# Altium schematic sheet first.SchDoc
size A; SheetNumber: 1; SheetTotal: 3
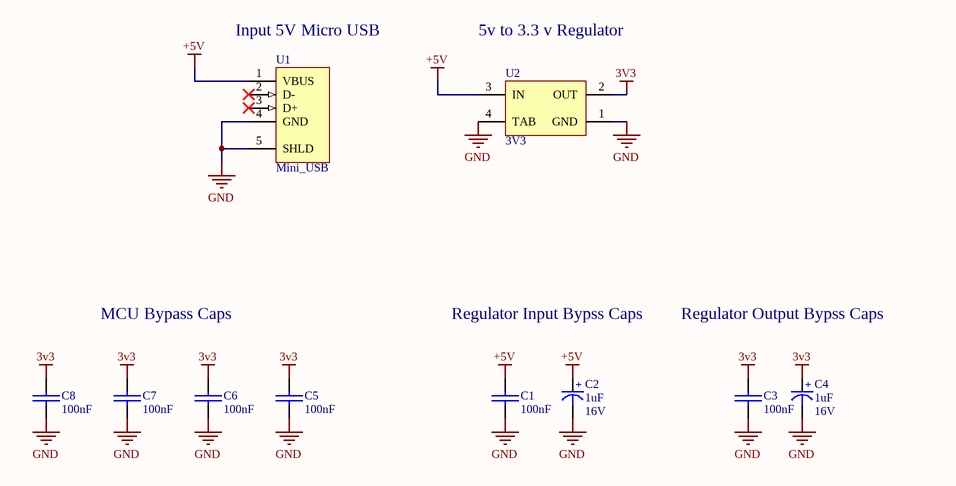
[diagram p0: first.SchDoc]

## Parts
C1  100nF  [SMD_CAP_1206]
C2  Voltage: 16V  [CAPP 2218  Size]  (hidden comment: 1uF)
C3  100nF  [SMD_CAP_1206]
C4  Voltage: 16V  [CAPP 2218  Size]  (hidden comment: 1uF)
C5  100nF  [SMD_CAP_1206]
C6  100nF  [SMD_CAP_1206]
C7  100nF  [SMD_CAP_1206]
C8  100nF  [SMD_CAP_1206]
U1  Mini_USB  [My_USB]
U2  3V3  [SOT223]

## Nets
3V3: C3.1(+) C4.1(+) C5.1(+) C6.1(+) C7.1(+) C8.1(+) U2.2(OUT)
+5V: C1.1(+) C2.1(+) U1.1(VBUS) U2.3(IN)
GND: C1.2(-) C2.2(-) C3.2(-) C4.2(-) C5.2(-) C6.2(-) C7.2(-) C8.2(-) U1.4(GND) U1.5(SHLD) U2.1(GND) U2.4(TAB)

Not connected (* = marked no-connect by the designer): U1 2(D-)* 3(D+)*

## Notes on the sheet
- (near U1) Input 5V Micro USB
- 5v to 3.3 v Regulator
- MCU Bypass Caps
- Regulator Input Bypss Caps
- Regulator Output Bypss Caps

## Library data of the parts
C1 C3 C5-C8 = Cap-Bipolar: Bipolar Capacitor; Voltage: 100V; Designer: Saeid Jorablo; Organazation: ControTec; Adding Date: 1387/12/20; Value: 100nF
C2 C4 = Cap-Polar: Polar Capacitor; Designer: Saeid Jorablo; Organazation: ControTec; Adding Date: 1387/12/20; Value: 1uF
U1 = Mini_USB: USB 2.0, Right Angle, SMT, B Type, Receptacle, 5 Position, Black; ContactMaterial: Copper Alloy; ContactPlating: Gold (30); PCB_Layout: Complies with manufacturer's recommendation.; DrillSize: Corresponds to nominal value.; PanelGround: Without; Published: 15-Jul-2004; DatasheetDocument: 27-Jun-2003; PackageDocument: 27-Jun-2003; PackageReference: 440247; Publisher: Altium Limited; HousingMaterial: Thermoplastic; ComponentLink1Description: Manufacturer Link; ComponentLink1URL: http://www.tycoelectronics.com/; ComponentLink2Description: Packaging Specification; ComponentLink2URL: http://ecommas.tycoelectronics.com/commerce/DocumentDelivery/DDEController?Action=showdoc&DocId=Customer+Drawing%7F440247%7FD%7Fpdf%7FEnglish%7FC_440247_D.pdf
U2 = AMS1117-x.x: x.x Volt, 800mA Low-Dropout Linear Regulator, 4-pin SOT-223; Designer: Ali Hafizi; Data: 16-12-2016